# EAGLE schematic untitled (EAGLE 8.0.1)
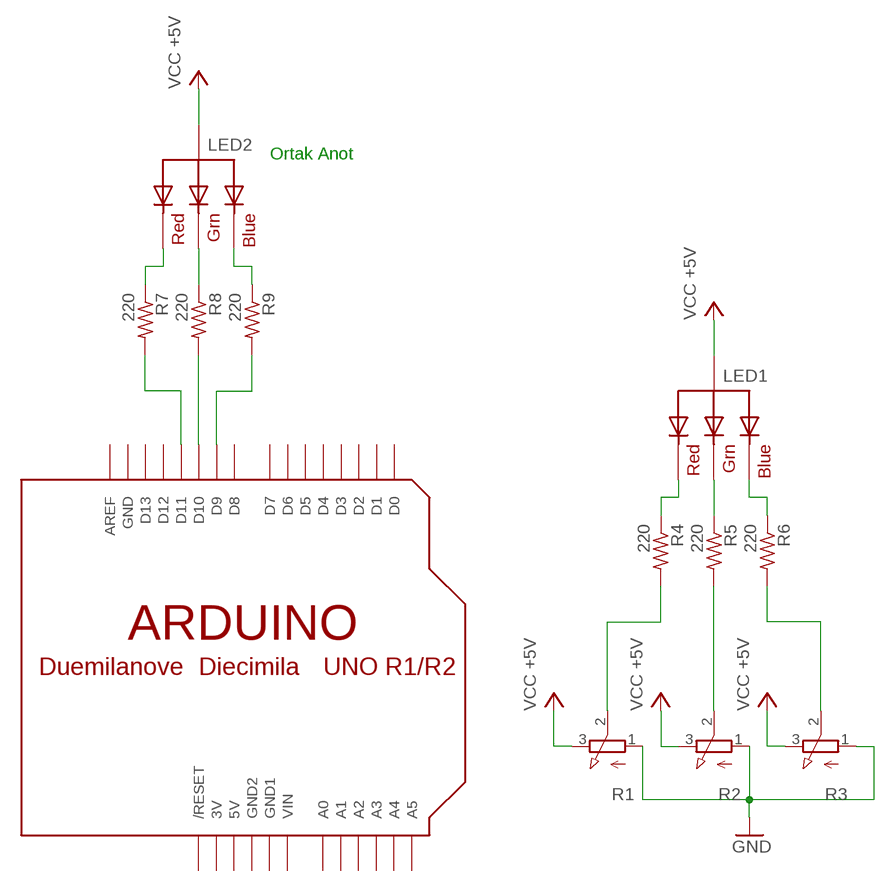
[diagram p0: schematic, sheet 1]

## Parts
LED1  RGBLED_CA-5MM  [LED5MMRGB]
LED2  RGBLED_CA-5MM  [LED5MMRGB]
R1  3RP/1610N  [3RP/1610N]
R2  3RP/1610N  [3RP/1610N]
R3  3RP/1610N  [3RP/1610N]
R4  220  R-US_0204/5  [0204/5]
R5  220  R-US_0204/5  [0204/5]
R6  220  R-US_0204/5  [0204/5]
R7  220  R-US_0204/5  [0204/5]
R8  220  R-US_0204/5  [0204/5]
R9  220  R-US_0204/5  [0204/5]
U$1  ARDUINOUNO  [ARDUINO]

## Nets
GND: R1.1(A) R2.1(A) R3.1(A)
N$1: LED1.4(BLUE) R6.1
N$2: LED1.3(GREEN) R5.1
N$3: LED1.1(RED) R4.1
N$4: R1.2(S) R4.2
N$5: R2.2(S) R5.2
N$6: R3.2(S) R6.2
N$7: LED2.4(BLUE) R9.1
N$8: LED2.3(GREEN) R8.1
N$9: LED2.1(RED) R7.1
N$10: R8.2 U$1.D10
N$11: R9.2 U$1.D9
N$12: R7.2 U$1.D11
VCC: LED1.2(VCC) LED2.2(VCC) R1.3(E) R2.3(E) R3.3(E) ; supply symbol labelled VCC +5V
Unconnected: U$1.A0 U$1.A1 U$1.A2 U$1.A3 U$1.A4 U$1.A5 U$1.AREF U$1.D0 U$1.D1 U$1.D2 U$1.D3 U$1.D4 U$1.D5 U$1.D6 U$1.D7 U$1.D8 U$1.D12 U$1.D13 U$1.RESET(/RESET)

## Notes on the sheet
- Ortak Anot

## Power pins joined to a net without a drawn wire
3V: U$1.3V
5V: U$1.5V
GND: U$1.GND
GND1: U$1.GND1
GND2: U$1.GND2
VIN: U$1.VIN

## Library data of the parts
LED1 LED2 = adafruit:RGBLED_CA: RGB LED, common-anode 5MM Staggered pins 5mm Piranha package http://www.ladyada.net/library/pcb/eaglelibrary.html
R1-R3 = pot:3RP/1610N: 16mm Potentiometer one level Source: http://www.alphapotentiometers.net/html/16mm_pot_2.html
R4-R9 = adafruit:R-US_: RESISTOR, American symbol
U$1 = adafruit:ARDUINO: Arduino Diecimila/Duemilanove Make a shield with ease, this package has all the named pins as well as the two mounting drill holes and an outline of the USB and DC power connector. The outline is on the DIMENSION layer, so if your board house uses it they will cut the outline to match. http://www.ladyada.net/library/pcb/eaglelibrary.html